# Altium schematic sheet USB_SERIAL_QUAD.SchDoc: AMC FMC Carrier v4.0.5
size 420 x 297 mm; CmpIndex: 15; Drawing Project: AMC FMC Carrier Board; SymIndex: 2141; CompanyName: WUT; Organization: WUT ISE; Address1: Warsaw University of Technology; Address2: Nowowiejska 15/19 00-665 Warsaw; Address3: t.przywozki@gmail.com; Revision: 1; SheetNumber: 28; SheetTotal: 29; Project: AMC FMC Carrier v4.0.5; ModifiedBy: F. Świtakowski; CheckedDate: -; Title2: Quad USB - serial; DivGrp: ISE; Designer: T. Przywozki; ModifiedDate: -; ProjectName: ADC/DAC MEZZANINE
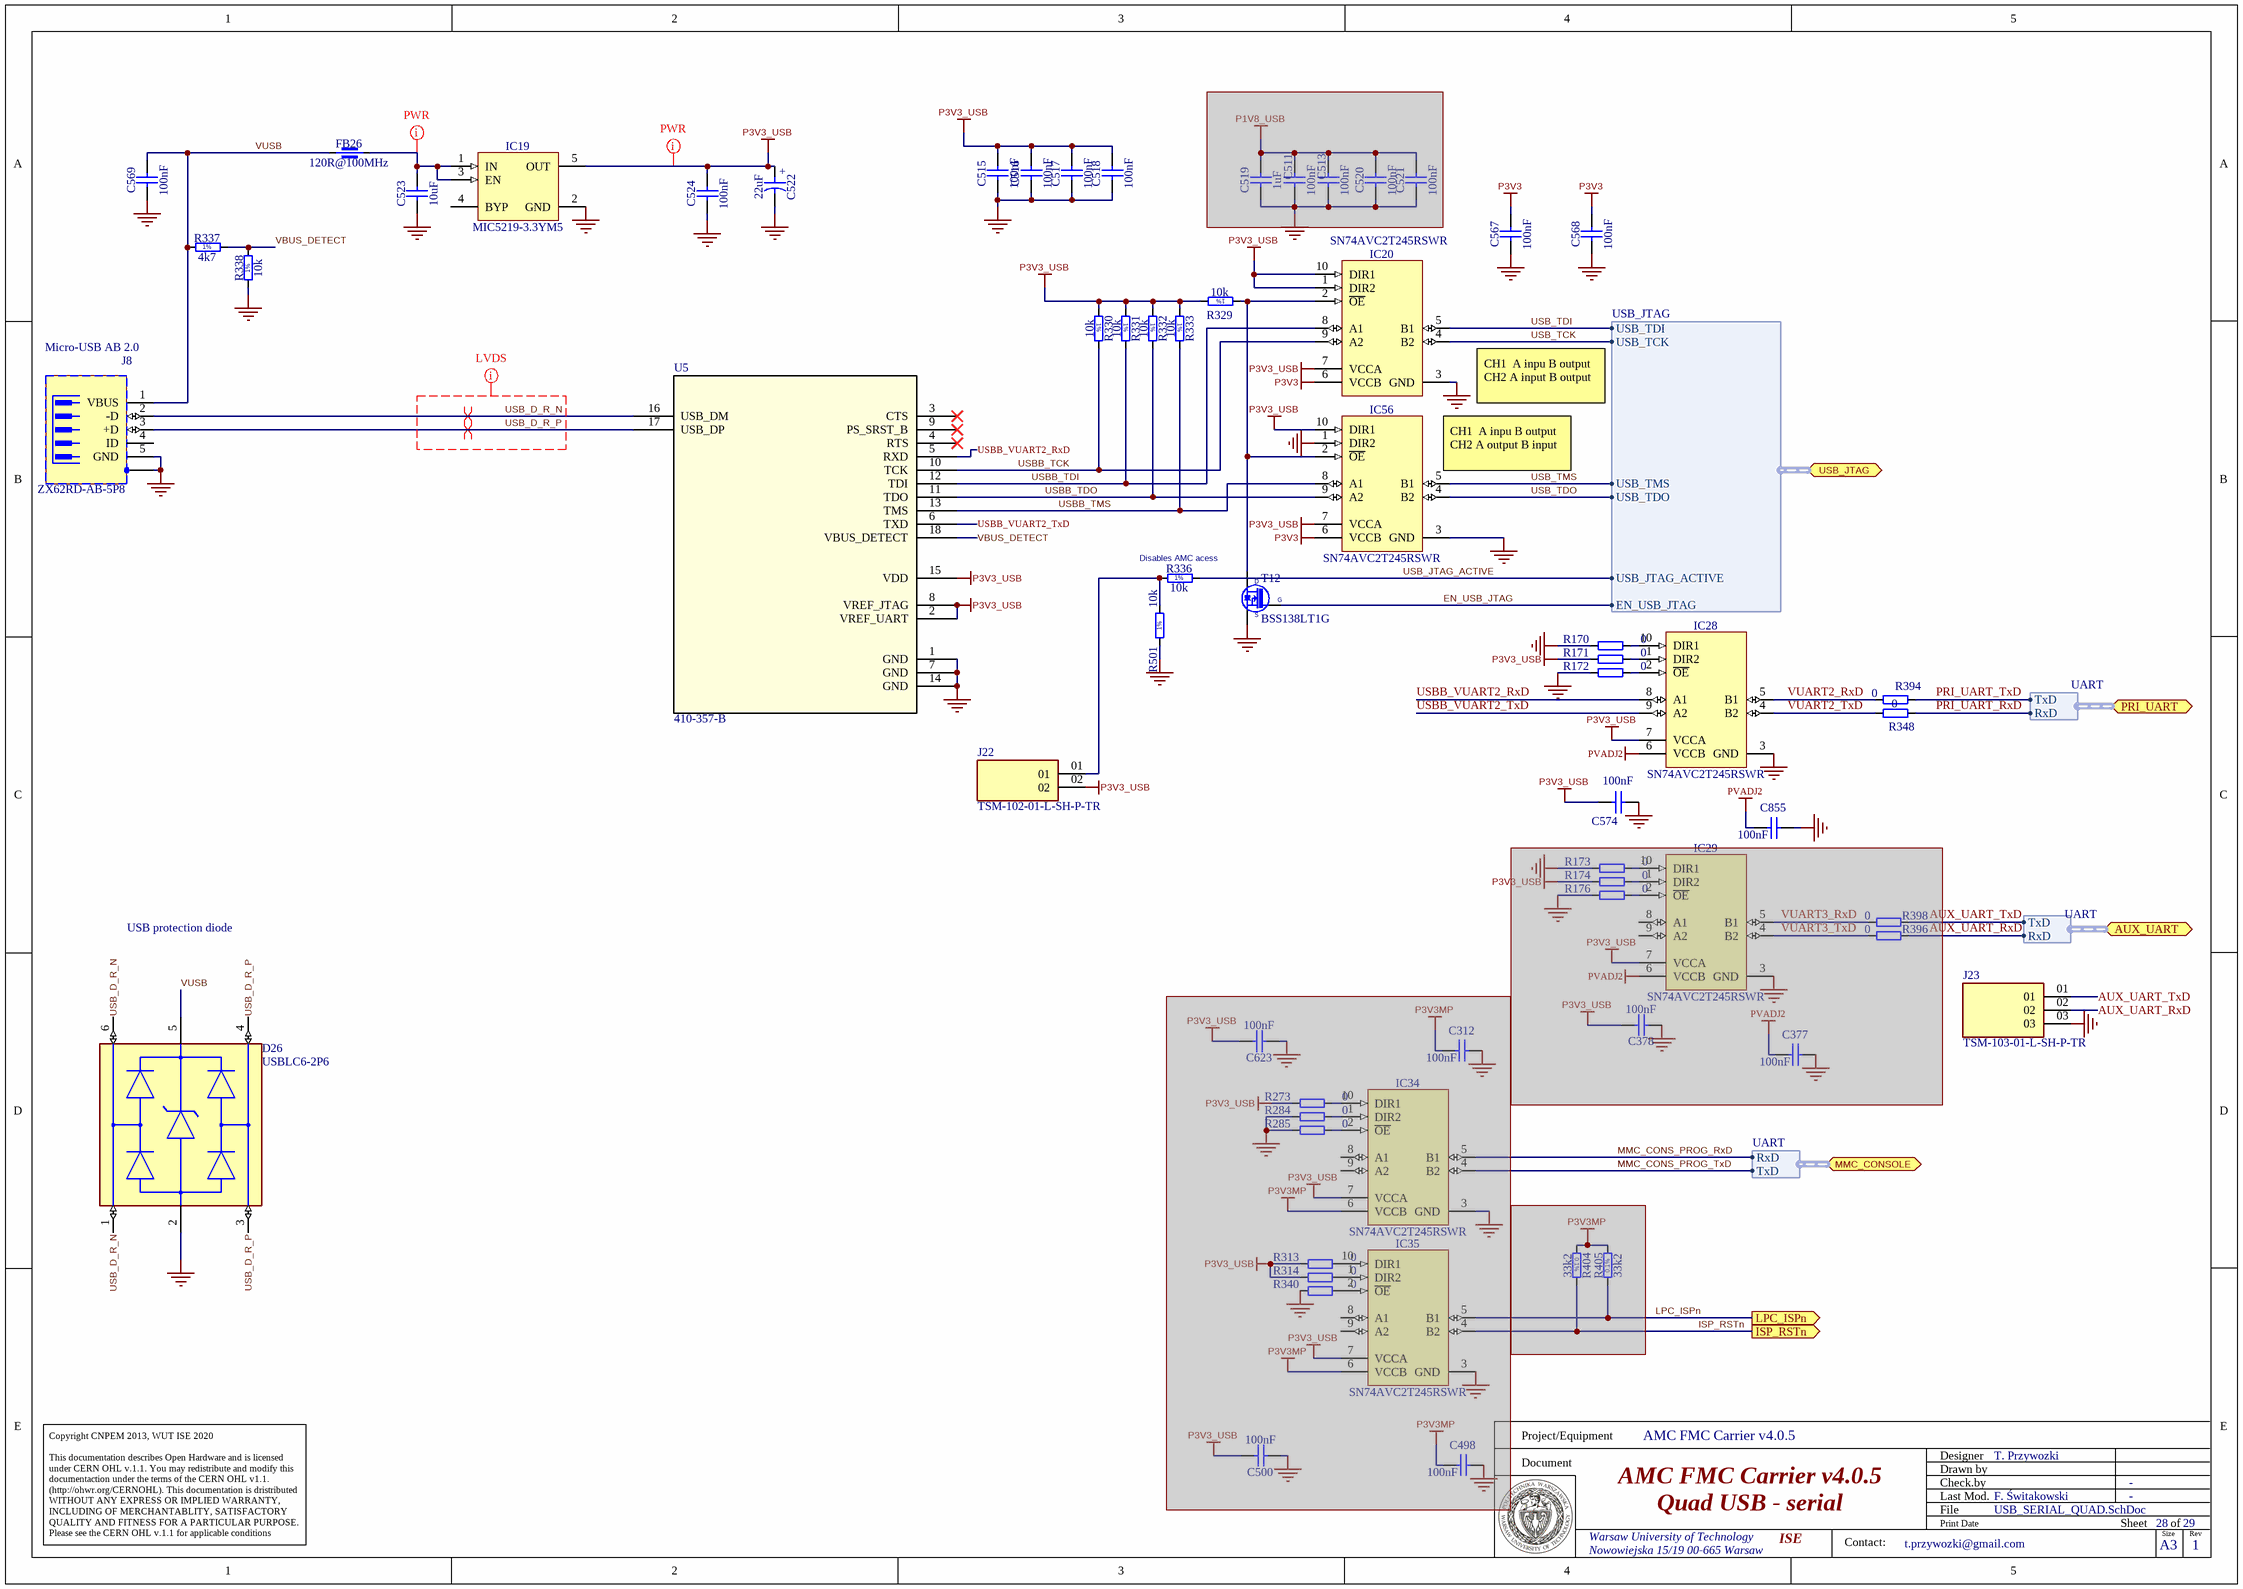
[diagram p0: USB_SERIAL_QUAD.SchDoc]

## Parts
C312  100nF  [CAPC0603X33N]  (masked out: inside a compile mask, not in the netlist)
C377  100nF  [CAPC0603X33N]  (masked out: inside a compile mask, not in the netlist)
C378  100nF  [CAPC0603X33N]  (masked out: inside a compile mask, not in the netlist)
C498  100nF  [CAPC0603X33N]  (masked out: inside a compile mask, not in the netlist)
C500  100nF  [CAPC0603X33N]  (masked out: inside a compile mask, not in the netlist)
C511  100nF  [CAPC0603X33N]  (masked out: inside a compile mask, not in the netlist)
C513  100nF  [CAPC0603X33N]  (masked out: inside a compile mask, not in the netlist)
C515  100nF  [CAPC0603X33N]
C516  100nF  [CAPC0603X33N]
C517  100nF  [CAPC0603X33N]
C518  100nF  [CAPC0603X33N]
C519  1uF  [CAPC1005X55N]  (masked out: inside a compile mask, not in the netlist)
C520  100nF  [CAPC0603X33N]  (masked out: inside a compile mask, not in the netlist)
C521  100nF  [CAPC0603X33N]  (masked out: inside a compile mask, not in the netlist)
C522  22uF  [CAPMP3216X180N]
C523  10uF  [CAPC1608X87N]
C524  100nF  [CAPC0603X33N]
C567  100nF  [CAPC0603X33N]
C568  100nF  [CAPC0603X33N]
C569  100nF  [CAPC0603X33N]
C574  100nF  [CAPC0603X33N]
C623  100nF  [CAPC0603X33N]  (masked out: inside a compile mask, not in the netlist)
C855  100nF  [CAPC0603X33N]
D26  USBLC6-2P6  [FP-SOT-666-MFG]
FB26  120R@100MHz  [INDC1608X65N]
IC19  MIC5219-3.3YM5  [SOT95P280X145-5N]
IC20  SN74AVC2T245RSWR  [QFN40P140X180X55-10N]
IC28  SN74AVC2T245RSWR  [QFN40P140X180X55-10N]
IC29  SN74AVC2T245RSWR  [QFN40P140X180X55-10N]  (masked out: inside a compile mask, not in the netlist)
IC34  SN74AVC2T245RSWR  [QFN40P140X180X55-10N]  (masked out: inside a compile mask, not in the netlist)
IC35  SN74AVC2T245RSWR  [QFN40P140X180X55-10N]  (masked out: inside a compile mask, not in the netlist)
IC56  SN74AVC2T245RSWR  [QFN40P140X180X55-10N]
J8  Micro-USB AB 2.0  Manufacturer Part Number: ZX62RD-AB-5P8  [HIROSE_ZX62RD-AB-5P8]
J22  TSM-102-01-L-SH-P-TR  [SAMTEC_TSM-102-01-L-SH-P-TR]
J23  TSM-103-01-L-SH-P-TR  [SAMTEC_TSM-103-01-L-SH-P-TR]
R170  0  [RESC0603X28N]
R171  0  [RESC0603X28N]
R172  0  [RESC0603X28N]
R173  0  [RESC0603X28N]  (masked out: inside a compile mask, not in the netlist)
R174  0  [RESC0603X28N]  (masked out: inside a compile mask, not in the netlist)
R176  0  [RESC0603X28N]  (masked out: inside a compile mask, not in the netlist)
R273  0  [RESC0603X28N]  (masked out: inside a compile mask, not in the netlist)
R284  0  [RESC0603X28N]  (masked out: inside a compile mask, not in the netlist)
R285  0  [RESC0603X28N]  (masked out: inside a compile mask, not in the netlist)
R313  0  [RESC0603X28N]  (masked out: inside a compile mask, not in the netlist)
R314  0  [RESC0603X28N]  (masked out: inside a compile mask, not in the netlist)
R329  10k  [RESC1005X40N]
R330  10k  [RESC1005X40N]
R331  10k  [RESC1005X40N]
R332  10k  [RESC1005X40N]
R333  10k  [RESC1005X40N]
R336  10k  [RESC1005X40N]
R337  4k7  [RESC1005X40N]
R338  10k  [RESC1005X40N]
R340  0  [RESC0603X28N]  (masked out: inside a compile mask, not in the netlist)
R348  0  [RESC1005X40N]
R394  0  [RESC1005X40N]
R396  0  [RESC1005X40N]  (masked out: inside a compile mask, not in the netlist)
R398  0  [RESC1005X40N]  (masked out: inside a compile mask, not in the netlist)
R404  33k2  [RESC1608X55N]  (masked out: inside a compile mask, not in the netlist)
R405  33k2  [RESC1608X55N]  (masked out: inside a compile mask, not in the netlist)
R501  10k  [RESC1005X40N]
T12  BSS138LT1G  [SOT95P240X110-3N]
U5  410-357-B  [QFN18_410-357-B_DGT]

## Ports
AUX_UART (bidir, harness UART), ISP_RSTn (out), LPC_ISPn (out), MMC_CONSOLE (bidir, harness UART), PRI_UART (bidir, harness UART), USB_JTAG (bidir, harness USB_JTAG)

## Harnesses
UART: RxD, TxD
USB_JTAG: USB_TDI, USB_TCK, USB_TMS, USB_TDO, USB_JTAG_ACTIVE, EN_USB_JTAG

## Nets
GND: C515.1 C516.1 C517.1 C518.1 C522.2 C523.1 C524.1 C567.1 C568.1 C569.1 C574.1 C855.1 D26.2(GND) IC19.2(GND) IC20.3(GND) IC28.3(GND) IC56.1(DIR2) IC56.3(GND) J8.5(GND) J8.6(SH) J23.03 R170.1 R172.1 R338.1 R501.1 T12.2(S) U5.1(GND) U5.7(GND) U5.14(GND)
P3V3: C567.2 C568.2 IC20.6(VCCB) IC56.6(VCCB)
P3V3_USB: C515.2 C516.2 C517.2 C518.2 C522.1 C524.2 C574.2 IC19.5(OUT) IC20.1(DIR2) IC20.7(VCCA) IC20.10(DIR1) IC28.7(VCCA) IC56.7(VCCA) IC56.10(DIR1) J22.02 R171.1 R329.2 R330.1 R331.1 R332.1 R333.1 U5.2(VREF_UART) U5.8(VREF_JTAG) U5.15(VDD)
PVADJ2: C855.2 IC28.6(VCCB)
AUX_UART_RxD: J23.02
AUX_UART_TxD: J23.01
EN_USB_JTAG: T12.1(G) ; port USB_JTAG.EN_USB_JTAG
ISP_RSTn: port ISP_RSTn
LPC_ISPn: port LPC_ISPn
MMC_CONS_PROG_RxD: port MMC_CONSOLE.RxD
MMC_CONS_PROG_TxD: port MMC_CONSOLE.TxD
PRI_UART_RxD: R348.1 ; port PRI_UART.RxD
PRI_UART_TxD: R394.1 ; port PRI_UART.TxD
USB_D_R_N: D26.1(I/O1) D26.6(I/O1) J8.2(-D) U5.16(USB_DM)
USB_D_R_P: D26.3(I/O2) D26.4(I/O2) J8.3(+D) U5.17(USB_DP)
USB_JTAG_ACTIVE: R336.2 ; port USB_JTAG.USB_JTAG_ACTIVE
USB_TCK: IC20.4(B2) ; port USB_JTAG.USB_TCK
USB_TDI: IC20.5(B1) ; port USB_JTAG.USB_TDI
USB_TDO: IC56.4(B2) ; port USB_JTAG.USB_TDO
USB_TMS: IC56.5(B1) ; port USB_JTAG.USB_TMS
USBB_TCK: IC20.9(A2) R330.2 U5.10(TCK)
USBB_TDI: IC20.8(A1) R331.2 U5.12(TDI)
USBB_TDO: IC56.9(A2) R332.2 U5.11(TDO)
USBB_TMS: IC56.8(A1) R333.2 U5.13(TMS)
USBB_VUART2_RxD: IC28.8(A1) U5.5(RXD)
USBB_VUART2_TxD: IC28.9(A2)
VBUS_DETECT: R337.2 R338.2 U5.18(VBUS_DETECT)
VUART2_RxD: IC28.5(B1) R394.2
VUART2_TxD: IC28.4(B2) R348.2
VUSB: C569.2 D26.5(VBUS) FB26.1 J8.1(VBUS) R337.1
NetC523_2: C523.2 FB26.2 IC19.1(IN) IC19.3(EN)
NetIC20_2: IC20.2(~{OE}) IC56.2(~{OE}) R329.1 T12.3(D)
NetIC28_1: IC28.1(DIR2) R171.2
NetIC28_2: IC28.2(~{OE}) R172.2
NetIC28_10: IC28.10(DIR1) R170.2
NetJ22_01: J22.01 R336.1 R501.2

Not connected (* = marked no-connect by the designer): IC19 4(BYP); J8 4(ID); U5 3(CTS)* 4(RTS)* 6(TXD) 9(PS_SRST_B)*

## Layout directives
net class PWR: NetC523_2, P3V3_USB
differential pair: USB_D_R_N, USB_D_R_P
net class LVDS: USB_D_R_N, USB_D_R_P

## Notes on the sheet
- CH1  A inpu B output
  CH2 A input B output
- (near IC56) CH1  A inpu B output
  CH2 A output B input
- (near R336) Disables AMC acess
- USB protection diode
- Labels drawn without touching a wire or pin: USBB_VUART2_TxD
- Project/Equipment
- Document
- Designer
- Drawn by
- Check.by
- Copyright CNPEM 2013, WUT ISE 2020
  This documentation describes Open Hardware and is licensed under CERN OHL v.1.1. You may redistribute and modify this documentaction under the terms of the CERN OHL v1.1.
  (http://ohwr.org/CERNOHL). This documentation is dristributed WITHOUT ANY EXPRESS OR IMPLIED WARRANTY, INCLUDING OF MERCHANTABLITY, SATISFACTORY QUALITY AND FITNESS FOR A PARTICULAR PURPOSE. Please see the CERN OHL v.1.1 for applicable conditions
- File
- Last Mod.
- Print Date
- Sheet
- Size
- A3
- of
- Rev
- Contact:
- (in symbol CTE3216-18_22UF_6.3V_10%_LESR0900) +
- (in symbol R0402_2K2_1%_0.0625W_100PPM) 1%
- (in symbol R0402_10K_1%_0.0625W_100PPM) 1%
- (in symbol R0603_33K2_0.1%_0.063W_10PPM) 0.1%

## Library data of the parts
C312 C377 C378 C498 C500 C511 C513 C515-C518 C520 C521 C524 C567-C569 C574 C623 C855 = CC0201_100NF_6.3V_10%_X5R: Non-polarised capacitor; Manufacturer: GENERIC; Part Description: SMD Multilayer Chip Ceramic Capacitor; Manufacturer1 Part Number: 02016D104KAT2A; Tolerance: ±10%; Voltage: 6.3V; TC: X5R; Manufacturer Part Number: CC0201_100NF_6.3V_10%_X5R; Part Number: CC0201_100NF_6.3V_10%_X5R; Value: 100nF; Component Kind: Standard; Component Type: Standard; Pin Count: 2; Status: Not Recommended; Case: 0201; Mounted: Yes; Socket: No; SMD: Yes; Sense: No; Manufacturer1 Example: AVX; Manufacturer1 ComponentHeight: 0.33mm; HelpURL: \\cern.ch\dfs\Applications\Altium\Datasheets\CC0201_X5R_AVX.pdf; Author: CERN DEM JLC; CreateDate: 03.12.2007; LatestRevisionDate: 03.12.2007
C519 = CC0402_1UF_16V_10%_X5R: Non-polarised capacitor; Manufacturer: GENERIC; Part Description: SMD Multilayer Chip Ceramic Capacitor; Manufacturer1 Part Number: C1005X5R1C105KT; Tolerance: ±10%; Voltage: 16V; TC: X5R; Manufacturer Part Number: CC0402_1UF_16V_10%_X5R; Part Number: CC0402_1UF_16V_10%_X5R; Value: 1uF; Component Kind: Standard; Component Type: Standard; Pin Count: 2; Status: Preferred; Case: 0402; Mounted: Yes; Socket: No; SMD: Yes; Sense: No; Manufacturer1 Example: TDK; Manufacturer1 ComponentHeight: 0.55mm; HelpURL: \\cern.ch\dfs\Applications\Altium\Datasheets\CC0402_X5R_TDK_C.pdf; Author: CERN DEM JLC; CreateDate: 25.10.2012; LatestRevisionDate: 25.10.2012
C522 = CTE3216-18_22UF_6.3V_10%_LESR0900: Polarised capacitor; Manufacturer: GENERIC; Part Description: Low ESR 0R9 Solid Tantalum Chip Capacitor; Manufacturer1 Part Number: TPSA226K006R0900; Tolerance: ±10%; Voltage: 6.3V; Manufacturer Part Number: CTE3216-18_22UF_6.3V_10%_LESR0900; Part Number: CTE3216-18_22UF_6.3V_10%_LESR0900; Value: 22uF; Component Kind: Standard; Component Type: Standard; Pin Count: 2; Status: Preferred; Case: A; Mounted: Yes; Socket: No; SMD: Yes; Sense: No; Manufacturer1 Example: AVX; Manufacturer1 ComponentHeight: 1.8mm; HelpURL: \\cern.ch\dfs\Applications\Altium\Datasheets\CTE-LESR_AVX_TPS.pdf; Author: CERN DEM JLC; CreateDate: 05.05.2008; LatestRevisionDate: 20.01.2009
C523 = CC0603_10UF_6.3V_20%_X5R: Non-polarised capacitor; Manufacturer: GENERIC; Part Description: SMD Multilayer Chip Ceramic Capacitor; Manufacturer1 Part Number: C0603C106M9PAC; Tolerance: ±20%; Voltage: 6.3V; TC: X5R; Manufacturer Part Number: CC0603_10uF_6.3V_20%_X5R; Part Number: CC0603_10UF_6.3V_20%_X5R; Value: 10uF; Component Kind: Standard; Component Type: Standard; Pin Count: 2; Status: Preferred; Case: 0603; Mounted: Yes; Socket: No; SMD: Yes; Sense: No; Manufacturer1 Example: KEMET; Manufacturer1 ComponentHeight: 0.95mm; HelpURL: \\cern.ch\dfs\Applications\Altium\Datasheets\CC0603_X5R_KEMET.pdf; Author: CERN DEM JLC; CreateDate: 03.12.2007; LatestRevisionDate: 03.12.2007
D26 = CMP-12225-000058-1: TVS DIODE 5.25V 17V SOT666; Min Breakdown Voltage: 6V; Power Line Protection: Yes; Element Configuration: Dual; Test Current: 1mA; Working Voltage: 5V; Number of Channels: 2; Max Reverse Leakage Current: 150nA; Direction: Unidirectional; Peak Pulse Current: 5A; Number of Elements: 1; Capacitance: 3.5pF; Max Breakdown Voltage: 6V; Height: 0.6mm; Depth: 1.3mm; Contact Plating: Tin; Reverse Breakdown Voltage: 6V; REACH SVHC: No SVHC; Operating Supply Voltage: 5V; Width: 1.3mm; Max Operating Temperature: 125°C; Reverse Standoff Voltage: 5V; ESD Protection: Yes; Package Quantity: 1; Termination: SMD/SMT; Length: 1.7mm; Leakage Current: 150nA; Number of Bidirectional Channels: 2; Case/Package: SOT-666; Min Operating Temperature: -40°C; Number of Pins: 6; Clamping Voltage: 17V; Breakdown Voltage: 6V; Lead Free: Lead Free; Radiation Hardening: No; Packaging: Tape and Reel; Mount: Surface Mount; Polarity: Unidirectional
FB26 = IND0603_MURATA_BLM18SG121TN1D: Manufacturer: MURATA; Part Description: SMD EMIFIL Suppression Chip Ferrite Bead; Tolerance: ±25%; Power: 3A; Resistance: 0.025R; Manufacturer Part Number: BLM18SG121TN1D; Part Number: IND0603_MURATA_BLM18SG121TN1D; Value: 120R@100MHz; Component Kind: Standard; Component Type: Standard; Pin Count: 2; Status: None; Case: 0603; Mounted: Yes; Socket: No; SMD: Yes; Sense: No; ComponentHeight: 0.65mm; HelpURL: \\cern.ch\dfs\Applications\Altium\Datasheets\IND0603_MURATA_BLM18S.pdf; Author: CERN DEM JLC; CreateDate: 23.07.2014; LatestRevisionDate: 25.10.2018
IC19 = MIC5219-3.3YM5: 500mA Peak Output LDO Regulator; Part Description: 3.3V 500mA Peak Output Low Drop-Out  (LDO) Regulator; Manufacturer: MICROCHIP TECHNOLOGY; PressFit: No; Bonding: No; Part Number: MIC5219-3.3YM5; Component Kind: Standard; Component Type: Standard; Device: MIC5219-3.3YM5; PackageDescription: SOT, 0.95mm pitch; 5 pin, 1.60mm W X 2.90mm L X 1.45mm H body, IPC Medium Density; Manufacturer Part Number: MIC5219-3.3YM5; Pin Count: 5; Case: SOT23-5; Mounted: Yes; Socket: No; SMD: Yes; Sense: No; ComponentHeight: 1.45mm; HelpURL: \\cern.ch\dfs\Applications\Altium\Datasheets\MIC5219-3.3YM5.pdf; Author: CERN DEM WB; CreateDate: 16.04.2019; LatestRevisionDate: 16.04.2019
IC20 IC28 IC29 IC34 IC35 IC56 = SN74AVC2T245RSWR: Dual-Bit Dual-Supply Bus Transceiver With Configurable Voltage Translation and 3-State Outputs; Manufacturer: TEXAS INSTRUMENTS; PressFit: No; Bonding: No; Manufacturer Part Number: SN74AVC2T245RSWR; PackageDescription: QFN, 0.40mm Pitch, Rect.;10 Pin, 1.80mm L X 1.40mm W X 0.55mm H Body, IPC Medium Density; Part Description: Dual-Bit Dual-Supply Bus Transceiver With Configurable Voltage Translation and 3-State Outputs; Part Number: SN74AVC2T245RSWR; Component Kind: Standard; Component Type: Standard; Device: SN74AVC2T245RSWR; Status: Not Recommended; Pin Count: 10; Case: QFN10; Mounted: Yes; Socket: No; SMD: Yes; Sense: No; ComponentHeight: 0.55mm; Author: CERN DEM JLC; HelpURL: \\cern.ch\dfs\Applications\Altium\Datasheets\SN74AVC2T245RSWR.pdf; CreateDate: 07.07.2014; LatestRevisionDate: 30.03.2017
J8 = HIROSE_ZX62RD-AB-5P8: 5 Pin + 1 Shield USB Receptacle; Manufacturer: HIROSE (HRS); Part Description: Micro-USB 2.0 Right Angle, SMD Type AB - Reverse (Top mount), Shell Through Hole; PressFit: No; Part Number: HIROSE_ZX62RD-AB-5P8; Component Kind: Standard; Component Type: Standard; Pin Count: 7; Family: Micro-USB AB 2.0; Mounted: Yes; Socket: No; SMD: Yes; Sense: No; Status: Obsolete; ComponentHeight: 2.35mm; HelpURL: \\cern.ch\dfs\Applications\Altium\Datasheets\HIROSE_ZX62RD-AB-5P8.pdf; ComponentLink1URL: \\cern.ch\dfs\Applications\Altium\Datasheets\HIROSE_ZX62RD-AB-5P8_Package-Drawing.pdf; ComponentLink1Description: Package-Drawing; Author: CERN DEM JLC; CreateDate: 29.10.2014; LatestRevisionDate: 22.06.2017
J22 = TSM-102-01-L-SH-P-TR: MF: Samtec; Availability: Unavailable; MP: TSM-102-01-L-SH-P-TR; Price: None; Package: None; Value: *
J23 = TSM-103-01-L-SH-P-TR: MF: Samtec; Availability: Unavailable; MP: TSM-103-01-L-SH-P-TR; Package: None; Value: *; Price: None
R170-R174 R176 R273 R284 R285 R313 R314 R340 = R0201_0R_JUMPER: Resistor; Part Description: 1A (0.05R Max DC Resistance) Zero Ohm Jumper; Manufacturer: GENERIC; Manufacturer1 Part Number: CRCW02010000Z0ED; PressFit: No; Part Number: R0201_0R_JUMPER; Component Kind: Standard; Component Type: Standard; Pin Count: 2; Value: 0; Status: Not Recommended; Manufacturer Part Number: R0201_0R_JUMPER; Case: 0201; Mounted: Yes; Sense: No; Socket: No; SMD: Yes; Manufacturer1 Example: VISHAY; Manufacturer1 ComponentHeight: 0.27mm; HelpURL: \\cern.ch\dfs\Applications\Altium\Datasheets\R0201_VISHAY_CRCW e3.pdf; Author: CERN DEM JLC; CreateDate: 19.11.2014; LatestRevisionDate: 08.01.2015
R329-R333 R336 R338 R501 = R0402_10K_1%_0.0625W_100PPM: Resistor - 1%; Manufacturer: GENERIC; Part Description: General Purpose Thick Film Chip Resistor; Manufacturer1 Part Number: 232270671003L; TC: ±100ppm/°C; PressFit: No; Manufacturer Part Number: R0402_10K_1%_0.0625W_100PPM; Part Number: R0402_10K_1%_0.0625W_100PPM; Tolerance: ±1%; Value: 10k; Component Kind: Standard; Component Type: Standard; Pin Count: 2; Status: Not Recommended; Power: 0.0625W; Case: 0402; Mounted: Yes; Sense: No; Socket: No; SMD: Yes; Manufacturer1 Example: YAGEO PHYCOMP; Manufacturer1 ComponentHeight: 0.4mm; HelpURL: \\cern.ch\dfs\Applications\Altium\Datasheets\R0402_Phycomp_RC0402.pdf; Author: CERN DEM JLC; CreateDate: 03.12.2007; LatestRevisionDate: 17.10.2012
R337 = R0402_2K2_1%_0.0625W_100PPM: Resistor - 1%; Manufacturer: GENERIC; Part Description: General Purpose Thick Film Chip Resistor; Manufacturer1 Part Number: 232270672202L; TC: ±100ppm/°C; PressFit: No; Manufacturer Part Number: R0402_2K2_1%_0.0625W_100PPM; Part Number: R0402_2K2_1%_0.0625W_100PPM; Tolerance: ±1%; Value: 4k7; Component Kind: Standard; Component Type: Standard; Pin Count: 2; Status: Not Recommended; Power: 0.0625W; Case: 0402; Mounted: Yes; Sense: No; Socket: No; SMD: Yes; Manufacturer1 Example: YAGEO PHYCOMP; Manufacturer1 ComponentHeight: 0.4mm; HelpURL: \\cern.ch\dfs\Applications\Altium\Datasheets\R0402_Phycomp_RC0402.pdf; Author: CERN DEM JLC; CreateDate: 03.12.2007; LatestRevisionDate: 17.10.2012
R348 R394 R396 R398 = R0402_0R_JUMPER: Resistor; Manufacturer: GENERIC; Part Description: 1A (0.05R Max DC Resistance) Zero Ohm Jumper; Manufacturer1 Part Number: 232270591001L; PressFit: No; Manufacturer Part Number: R0402_0R_JUMPER; Part Number: R0402_0R_JUMPER; Value: 0; Component Kind: Standard; Component Type: Standard; Pin Count: 2; Status: Not Recommended; Case: 0402; Mounted: Yes; Sense: No; Socket: No; SMD: Yes; Manufacturer1 Example: YAGEO PHYCOMP; Manufacturer1 ComponentHeight: 0.4mm; HelpURL: \\cern.ch\dfs\Applications\Altium\Datasheets\R0402_Phycomp_RC0402.pdf; Author: CERN DEM JLC; CreateDate: 03.12.2007; LatestRevisionDate: 17.10.2012
R404 R405 = R0603_33K2_0.1%_0.063W_10PPM: Resistor - 0.1%; Manufacturer: GENERIC; Part Description: Thin Film Chip Resistor; Manufacturer1 Part Number: RN73C1J33K2BTDF; Power: 0.063W; TC: ±10ppm; PressFit: No; Manufacturer Part Number: R0603_33K2_0.1%_0.063W_10PPM; Part Number: R0603_33K2_0.1%_0.063W_10PPM; Tolerance: ±0.1%; Value: 33k2; Component Kind: Standard; Component Type: Standard; Pin Count: 2; Status: Not Recommended; Case: 0603; Mounted: Yes; Sense: No; Socket: No; SMD: Yes; Manufacturer1 Example: TYCO HOLSWORTHY; Manufacturer1 ComponentHeight: 0.5mm; HelpURL: \\cern.ch\dfs\Applications\Altium\Datasheets\R0603_Tyco_RN73.pdf; Author: CERN DEM JLC; CreateDate: 03.12.2007; LatestRevisionDate: 13.03.2008
T12 = BSS138LT1G: N-CHANNEL MOSFET WITH DIODE; Manufacturer: ON SEMICONDUCTOR; Part Description: 50V 200mA N-Channel Enhancement Mode Field-Effect Transistor; PressFit: No; Bonding: No; Manufacturer Part Number: BSS138LT1G; PackageDescription: SOT23 3-Leads, Pitch 0.95mm - Body 1.4x3mm, IPC Medium Density; Part Number: BSS138LT1G; Component Kind: Standard; Component Type: Standard; Device: BSS138LT1G; Pin Count: 3; Case: SOT23-3; Mounted: Yes; Socket: No; SMD: Yes; Sense: No; ComponentHeight: 1.11mm; HelpURL: \\cern.ch\dfs\Applications\Altium\Datasheets\BSS138LT1G.pdf; Author: CERN DEM JLC; CreateDate: 23.03.2009; LatestRevisionDate: 23.03.2009
U5 = 410-357-B: Description; Manufacturer_Name: Digilent; Copyright: Copyright (C) 2026 Ultra Librarian. All rights reserved.; Manufacturer_Part_Number: 410-357-B; RefDes: RefDes; Type: Type; Manufacturer: Digilent; Part Number: 410-357-B